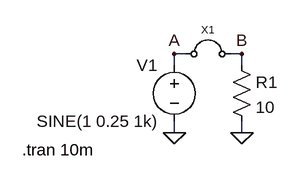
[diagram p0: schematic test-jumper.asc]
test-jumper.asc, the LTspice schematic file:
Version 4
SHEET 1 880 680
WIRE 48 128 32 128
WIRE 128 128 112 128
WIRE 32 144 32 128
WIRE 128 144 128 128
WIRE 32 240 32 224
WIRE 128 240 128 224
FLAG 32 128 A
FLAG 128 128 B
FLAG 32 240 0
FLAG 128 240 0
SYMBOL voltage 32 128 M0
WINDOW 123 0 0 Left 0
WINDOW 39 0 0 Left 0
SYMATTR InstName V1
SYMATTR Value SINE(1 0.25 1k)
SYMBOL res 112 128 R0
SYMATTR InstName R1
SYMATTR Value 10
SYMBOL jumper2 80 64 R0
SYMATTR InstName X1
TEXT -184 264 Left 2 !.tran 10m

The netlist it stands for:
* test-jumper.asc
V1 A 0 SINE(1 0.25 1k)
R1 B 0 10
XX1 A B jumper2  ; pins + -
.tran 10m
.backanno
.end